# Altium schematic sheet Cyusb3014 - 2.SchDoc
size A3
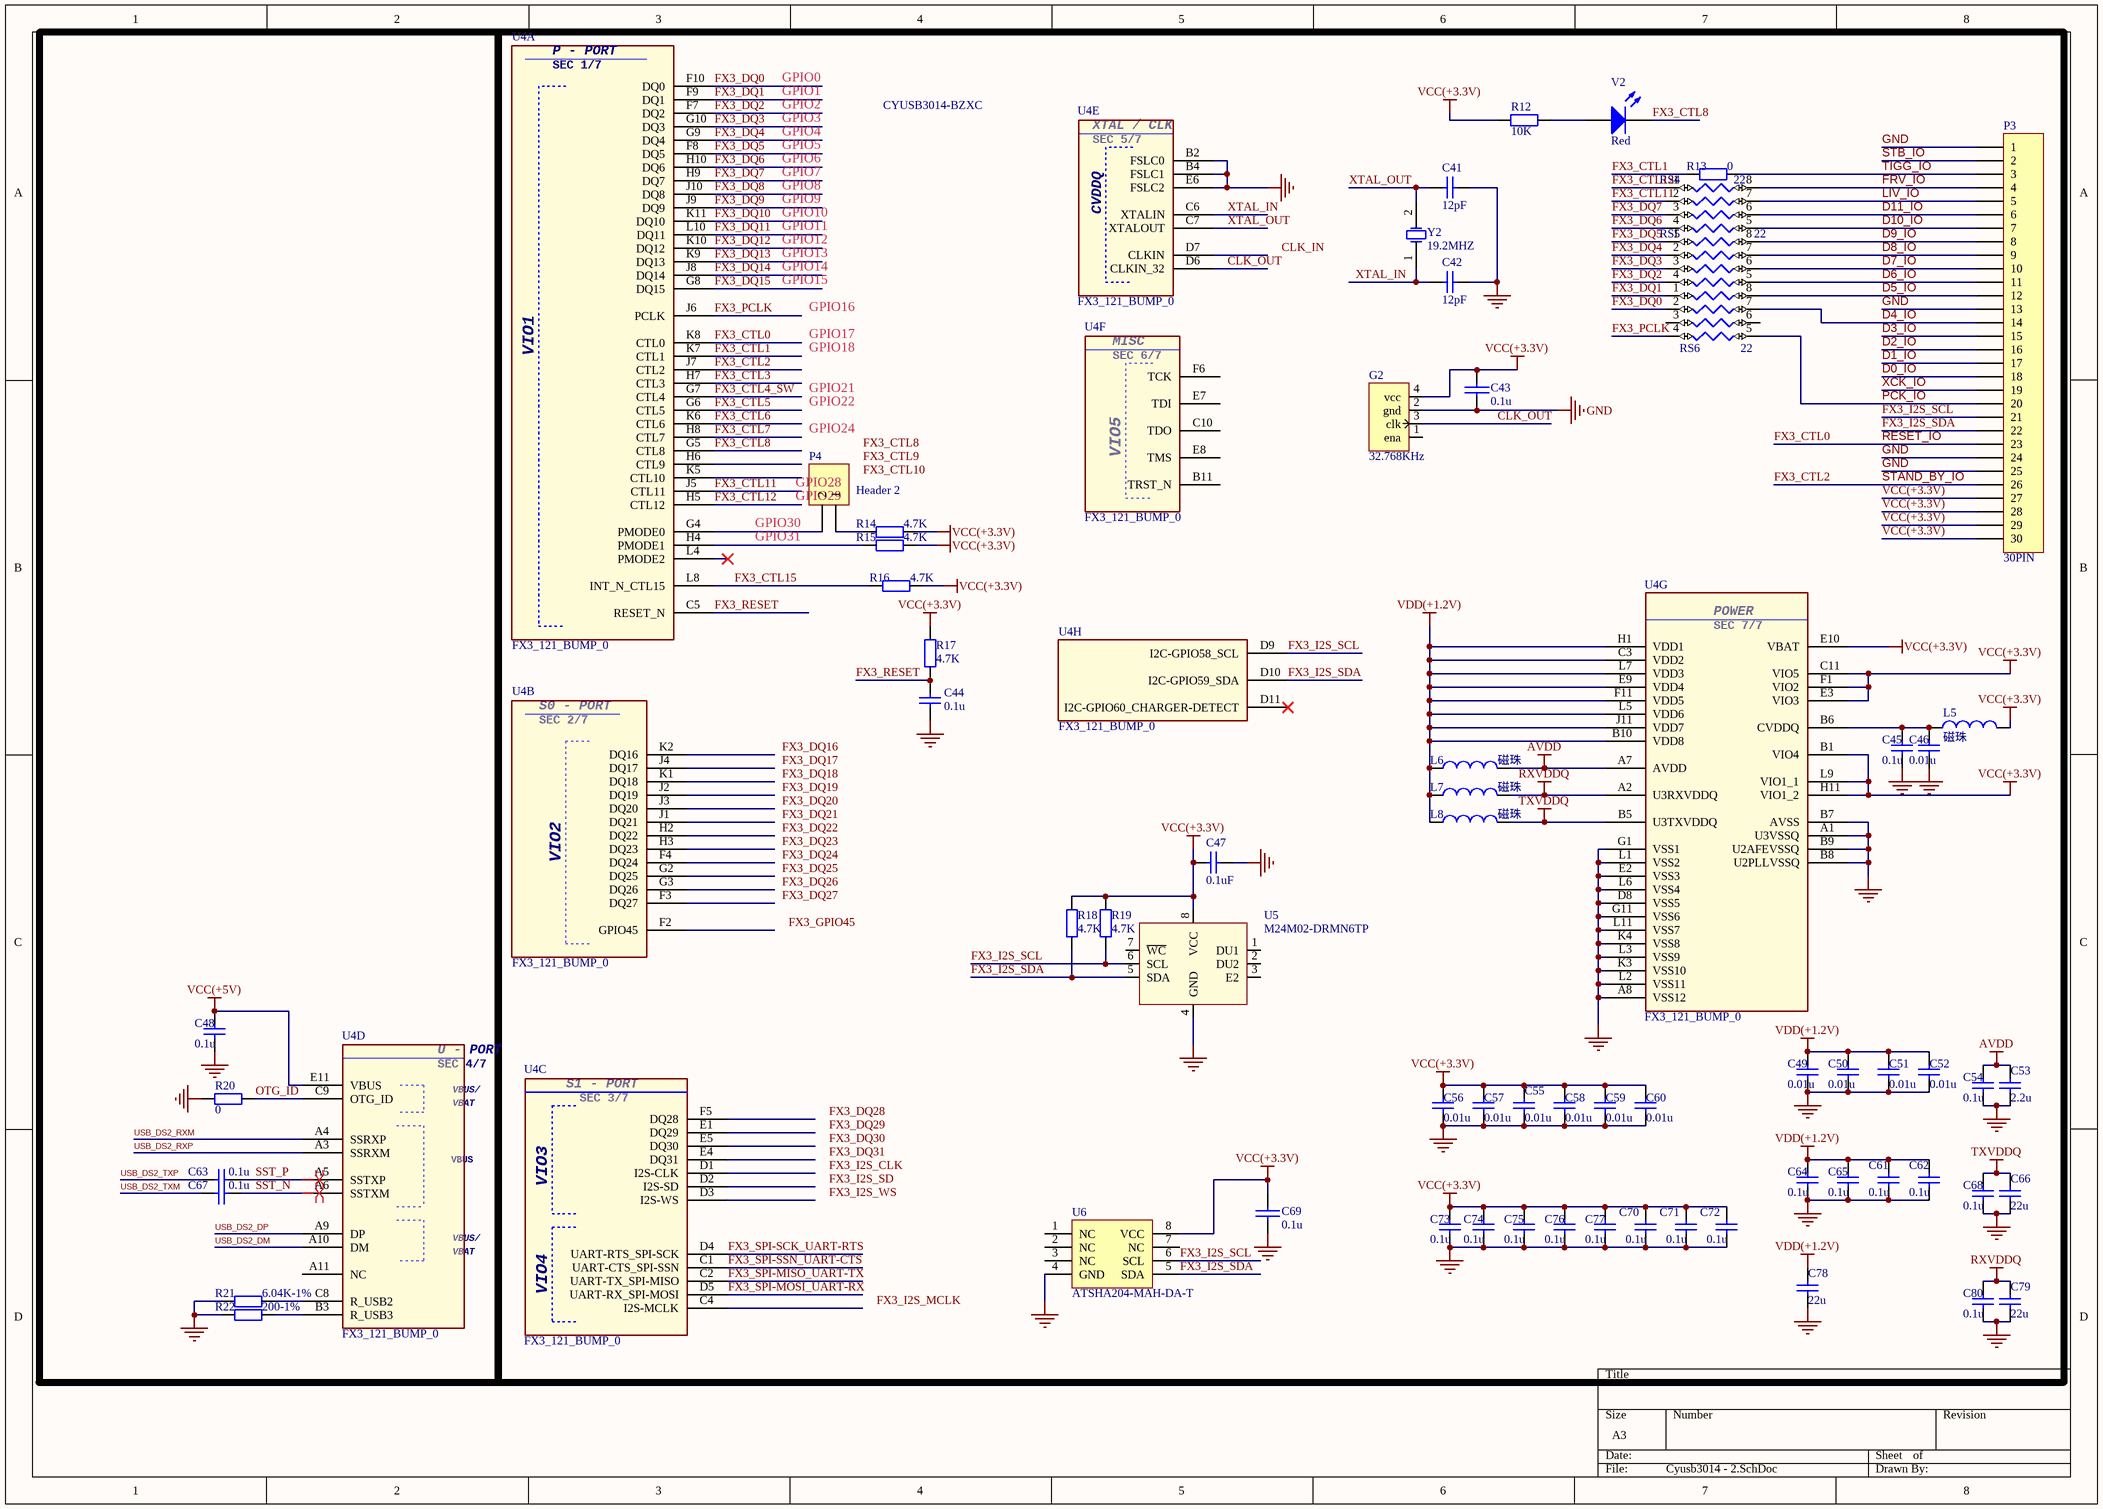
[diagram p0: Cyusb3014 - 2.SchDoc]

## Parts
C41  12pF  [0603S-CAP]
C42  12pF  [0603S-CAP]
C43  0.1u  [0603S-CAP]
C44  0.1u  [0603S-CAP]
C45  0.1u  [C0402]
C46  0.01u  [C0402]
C47  0.1uF  [0603S-CAP]
C48  0.1u  [C0402]
C49  0.01u  [C0402]
C50  0.01u  [C0402]
C51  0.01u  [C0402]
C52  0.01u  [C0402]
C53  2.2u  [C0805S-CAP]
C54  0.1u  [C0402]
C55  0.01u  [C0402]
C56  0.01u  [C0402]
C57  0.01u  [C0402]
C58  0.01u  [C0402]
C59  0.01u  [C0402]
C60  0.01u  [C0402]
C61  0.1u  [C0402]
C62  0.1u  [C0402]
C63  0.1u  [C0402]
C64  0.1u  [C0402]
C65  0.1u  [C0402]
C66  22u  [C0805S-CAP]
C67  0.1u  [C0402]
C68  0.1u  [C0402]
C69  0.1u  [0603S-CAP]
C70  0.1u  [C0402]
C71  0.1u  [C0402]
C72  0.1u  [C0402]
C73  0.1u  [C0402]
C74  0.1u  [C0402]
C75  0.1u  [C0402]
C76  0.1u  [C0402]
C77  0.1u  [C0402]
C78  22u  [C0805S-CAP]
C79  22u  [C0805S-CAP]
C80  0.1u  [C0402]
G2  32.768KHz  [爱普生晶振3.2×2.5mm]
L5  磁珠  [L0603]
L6  磁珠  [L0603]
L7  磁珠  [L0603]
L8  磁珠  [L0603]
P3  30PIN  [FH12-30S-0.5SH]
P4  Header 2  [HDR1X2]
R12  10K  [0603S-RES]
R13  0  [0603S-RES]
R14  4.7K  [0603S-RES]
R15  4.7K  [0603S-RES]
R16  4.7K  [0603S-RES]
R17  4.7K  [0603S-RES]
R18  4.7K  [0603S-RES]
R19  4.7K  [0603S-RES]
R20  0  [0603S-RES]
R21  6.04K-1%  [0603S-RES]
R22  200-1%  [0603S-RES]
RS4  22  [NC06-4]
RS5  22  [NC06-4]
RS6  22  [NC06-4]
U4  FX3_121_BUMP_0  [121_BGA_FX3]  (parts A,B,C,D,E,F,G,H of 8)
U5  M24M02-DRMN6TP  [SOIC127P600X175-8N]
U6  ATSHA204-MAH-DA-T  [UDFN]
V2  Red  [LED0805S]
Y2  19.2MHZ  [爱普生晶振3.2×2.5MM - 无源]

## Nets
AVDD: C53.2 C54.1 L6.2 U4.A7(AVDD)
GND: C41.1 C42.1 C43.2 C44.1 C45.2 C46.2 C47.1 C48.2 C49.2 C50.2 C51.2 C52.2 C53.1 C54.2 C55.2 C56.2 C57.2 C58.2 C59.2 C60.2 C61.2 C62.2 C64.2 C65.2 C66.1 C68.2 C69.2 C70.2 C71.2 C72.2 C73.2 C74.2 C75.2 C76.2 C77.2 C78.1 C79.1 C80.2 G2.2(gnd) P3.1 P3.13 P3.24 P3.25 R20.2 R21.2 R22.2 U4.A1(U3VSSQ) U4.A8(VSS12) U4.B2(FSLC0) U4.B4(FSLC1) U4.B7(AVSS) U4.B8(U2PLLVSSQ) U4.B9(U2AFEVSSQ) U4.D8(VSS5) U4.E2(VSS3) U4.E6(FSLC2) U4.G1(VSS1) U4.G11(VSS6) U4.K3(VSS10) U4.K4(VSS8) U4.L1(VSS2) U4.L2(VSS11) U4.L3(VSS9) U4.L6(VSS4) U4.L11(VSS7) U5.4(GND) U6.4(GND)
RXVDDQ: C79.2 C80.1 L7.2 U4.A2(U3RXVDDQ)
TXVDDQ: C66.2 C68.1 L8.2 U4.B5(U3TXVDDQ)
VCC(+3.3V): C43.1 C47.2 C55.1 C56.1 C57.1 C58.1 C59.1 C60.1 C69.1 C70.1 C71.1 C72.1 C73.1 C74.1 C75.1 C76.1 C77.1 G2.4(vcc) L5.2 P3.27 P3.28 P3.29 P3.30 R12.2 R14.2 R15.2 R16.1 R17.1 R18.2 R19.2 U4.B1(VIO4) U4.C11(VIO5) U4.E3(VIO3) U4.E10(VBAT) U4.F1(VIO2) U4.H11(VIO1_2) U4.L9(VIO1_1) U5.8(VCC) U6.8(VCC)
VCC(+5V): C48.1 U4.E11(VBUS)
VDD(+1.2V): C49.1 C50.1 C51.1 C52.1 C61.1 C62.1 C64.1 C65.1 C78.2 L6.1 L7.1 L8.1 U4.B10(VDD8) U4.C3(VDD2) U4.E9(VDD4) U4.F11(VDD5) U4.H1(VDD1) U4.J11(VDD7) U4.L5(VDD6) U4.L7(VDD3)
CLK_OUT: G2.3(clk) U4.D6(CLKIN_32)
D0_IO: P3.18
D1_IO: P3.17
D2_IO: P3.16
D3_IO: P3.15
D4_IO: P3.14 RS6.7
D5_IO: P3.12 RS6.8
D6_IO: P3.11 RS5.5
D7_IO: P3.10 RS5.6
D8_IO: P3.9 RS5.7
D9_IO: P3.8 RS5.8
D10_IO: P3.7 RS4.5
D11_IO: P3.6 RS4.6
FRV_IO: P3.4 RS4.8
FX3_CTL0: P3.23 U4.K8(CTL0)  [also labelled RESET_IO]
FX3_CTL1: R13.2 U4.K7(CTL1)
FX3_CTL2: P3.26 U4.J7(CTL2)  [also labelled STAND_BY_IO]
FX3_CTL3: U4.H7(CTL3)
FX3_CTL4_SW: U4.G7(CTL4)
FX3_CTL5: U4.G6(CTL5)
FX3_CTL6: U4.K6(CTL6)
FX3_CTL7: U4.H8(CTL7)
FX3_CTL8: U4.G5(CTL8) V2.2(K)
FX3_CTL11: RS4.2 U4.J5(CTL11)
FX3_CTL12: RS4.1 U4.H5(CTL12)
FX3_CTL15: R16.2 U4.L8(INT_N_CTL15)
FX3_DQ0: RS6.2 U4.F10(DQ0)
FX3_DQ1: RS6.1 U4.F9(DQ1)
FX3_DQ2: RS5.4 U4.F7(DQ2)
FX3_DQ3: RS5.3 U4.G10(DQ3)
FX3_DQ4: RS5.2 U4.G9(DQ4)
FX3_DQ5: RS5.1 U4.F8(DQ5)
FX3_DQ6: RS4.4 U4.H10(DQ6)
FX3_DQ7: RS4.3 U4.H9(DQ7)
FX3_DQ8: U4.J10(DQ8)
FX3_DQ9: U4.J9(DQ9)
FX3_DQ10: U4.K11(DQ10)
FX3_DQ11: U4.L10(DQ11)
FX3_DQ12: U4.K10(DQ12)
FX3_DQ13: U4.K9(DQ13)
FX3_DQ14: U4.J8(DQ14)
FX3_DQ15: U4.G8(DQ15)
FX3_I2S_SCL: P3.21 R19.1 U4.D9(I2C-GPIO58_SCL) U5.6(SCL) U6.6(SCL)
FX3_I2S_SDA: P3.22 R18.1 U4.D10(I2C-GPIO59_SDA) U5.5(SDA) U6.5(SDA)
FX3_PCLK: RS6.4 U4.J6(PCLK)
FX3_RESET: C44.2 R17.2 U4.C5(RESET_N)
FX3_SPI-MISO_UART-TX: U4.C2(UART-TX_SPI-MISO)
FX3_SPI-MOSI_UART-RX: U4.D5(UART-RX_SPI-MOSI)
FX3_SPI-SCK_UART-RTS: U4.D4(UART-RTS_SPI-SCK)
FX3_SPI-SSN_UART-CTS: U4.C1(UART-CTS_SPI-SSN)
LIV_IO: P3.5 RS4.7
OTG_ID: R20.1 U4.C9(OTG_ID)
PCK_IO: P3.20 RS6.5
SST_N: C67.2 U4.A6(SSTXM)
SST_P: C63.2 U4.A5(SSTXP)
STB_IO: P3.2
TIGG_IO: P3.3 R13.1
USB_DS2_DM: U4.A10(DM)
USB_DS2_DP: U4.A9(DP)
USB_DS2_RXM: U4.A4(SSRXP)
USB_DS2_RXP: U4.A3(SSRXM)
USB_DS2_TXM: C67.1
USB_DS2_TXP: C63.1
XCK_IO: P3.19
XTAL_IN: C42.2 U4.C6(XTALIN) Y2.1(OSC1)
XTAL_OUT: C41.2 U4.C7(XTALOUT) Y2.2(OSC2)
NetC45_1: C45.1 C46.1 L5.1 U4.B6(CVDDQ)
NetP4_1: P4.1 R14.1
NetP4_2: P4.2 U4.G4(PMODE0)
NetR12_1: R12.1 V2.1(A)
NetR15_1: R15.1 U4.H4(PMODE1)
NetR21_1: R21.1 U4.C8(R_USB2)
NetR22_1: R22.1 U4.B3(R_USB3)

Not connected (* = marked no-connect by the designer): G2 1(ena); RS6 3 6; U4 A11(NC) B11(TRST_N) C4(I2S-MCLK) C10(TDO) D1(I2S-CLK) D2(I2S-SD) D3(I2S-WS) D7(CLKIN) D11(I2C-GPIO60_CHARGER-DETECT)* E1(DQ29) E4(DQ31) E5(DQ30) E7(TDI) E8(TMS) F2(GPIO45) F3(DQ27) F4(DQ24) F5(DQ28) F6(TCK) G2(DQ25) G3(DQ26) H2(DQ22) H3(DQ23) H6(CTL9) J1(DQ21) J2(DQ19) J3(DQ20) J4(DQ17) K1(DQ18) K2(DQ16) K5(CTL10) L4(PMODE2)*; U5 1(DU1) 2(DU2) 3(E2) 7(~{WC}); U6 1(NC) 2(NC) 3(NC) 7(NC)

## Layout directives
differential pair: SST_N, SST_P

## Notes on the sheet
- GPIO0
- GPIO1
- GPIO2
- CYUSB3014-BZXC
- GPIO3
- GPIO4
- GPIO5
- GPIO6
- GPIO7
- GPIO8
- GPIO9
- GPIO10
- GPIO11
- GPIO12
- GPIO13
- GPIO14
- GPIO15
- GPIO16
- GPIO17
- GPIO18
- GPIO21
- GPIO22
- GPIO24
- (near P4) GPIO28
- (near P4) GPIO29
- (near P4) GPIO30
- (near P4) GPIO31
- Labels drawn without touching a wire or pin: CLK_IN, FX3_CTL8, FX3_CTL9, FX3_CTL10, FX3_DQ16, FX3_DQ17, FX3_DQ18, FX3_DQ19, FX3_DQ20, FX3_DQ21, FX3_DQ22, FX3_DQ23, FX3_DQ24, FX3_DQ25, FX3_DQ26, FX3_DQ27, FX3_DQ28, FX3_DQ29, FX3_DQ30, FX3_DQ31, FX3_GPIO45, FX3_I2S_CLK, FX3_I2S_MCLK, FX3_I2S_SD, FX3_I2S_WS
- (in symbol FX3_121_BUMP_0, part A) P - PORT; SEC 1/7; VIO1
- (in symbol FX3_121_BUMP_0, part B) S0 - PORT; SEC 2/7
- (in symbol FX3_121_BUMP_0, part C) S1 - PORT; SEC 3/7
- (in symbol FX3_121_BUMP_0, part D) U - PORT; SEC 4/7; VBUS/
- (in symbol FX3_121_BUMP_0, part E) XTAL / CLK; SEC 5/7
- (in symbol FX3_121_BUMP_0, part F) MISC; SEC 6/7
- (in symbol FX3_121_BUMP_0, part G) POWER; SEC 7/7

## Library data of the parts
C41 C42 = CAP CER SMT 4.3pF 0805: 2. Manufacturere Part Number: C0805C439D5GACTU; 1. Manufacturer: Kemet; 8. Alternate Part: any; 7. Package / Case: 0805; 0. Do Not Install: DNI; 6. Mounting Type: SMT; 5. Supplier Link: http://www.digikey.com/product-detail/en/C0805C439D5GACTU/C0805C439D5GACTU-ND/2212763; 3. Supplier: Digi-Key; 4. Supplier Part Number: C0805C439D5GACTU-ND
C43 C69 = CAP: RC=1206
C44 = Cap: 50V/8.2u/0805; Value: 100n; Published: 8-Jun-2000; LatestRevisionDate: 17-Jul-2002; LatestRevisionNote: Re-released for DXP Platform.; PackageReference: RAD-0.3; Publisher: Altium Limited
C45 C46 C48-C68 C70-C80 = CAP0805: Capacitor; Value: 104; Published: 8-Jun-2000; Revision: July-2002: Re-released for DXP Platform.; Publisher: Altium Limited
C47 = CAP SMT 0.1uF 16V X7R: 2. Manufacturere Part Number: C0805C104K4RACTU; 1. Manufacturer: Kemet; 8. Alternate Part: any; 7. Package / Case: 0805; 6. Mounting Type: SMT; 5. Supplier Link: http://www.digikey.com/product-detail/en/C0805C104K4RACTU/399-1167-1-ND/411442; 3. Supplier: Digi-Key; 4. Supplier Part Number: 399-1167-1-ND
G2 = CTY4-B
L5-L8 = Inductor: Code_IEC: 1005; Value: 10mH; Published: 8-Jun-2000; LatestRevisionDate: 29-May-2009; LatestRevisionNote: IPC-7351 Footprint Added.; PackageReference: 0402-A; Publisher: Altium Limited; PackageDescription: Chip Inductor; Code_JEITA: 0402
P3 = Header 30: Header, 30-Pin; LatestRevisionDate: 17-Jul-2002; LatestRevisionNote: Re-released for DXP Platform.; Publisher: Altium Limited
P4 = Header 2: Header, 2-Pin; LatestRevisionDate: 17-Jul-2002; LatestRevisionNote: Re-released for DXP Platform.; Publisher: Altium Limited
R12 = Res2: Resistor; Published: 8-Jun-2000; LatestRevisionDate: 17-Jul-2002; LatestRevisionNote: Re-released for DXP Platform.; PackageReference: AXIAL-0.4; Publisher: Altium Limited; Value: 10K
R13-R22 = Res2: Resistor; Value: 10K; Published: 8-Jun-2000; LatestRevisionDate: 17-Jul-2002; LatestRevisionNote: Re-released for DXP Platform.; PackageReference: AXIAL-0.4; Publisher: Altium Limited
RS4-RS6 = RN4: Option 2 - Device: *; Option 2 - Spec: *; Option 3 - Device: *; Option 3 - Spec: *; Option 4 - Device: *; Option 4 - Spec: *; Option 5 - Device: *; Option 5 - Spec: *; Option 6 - Device: *; Option 6 - Spec: *; Option 7 - Device: *; Option 7 - Spec: *; Option 8 - Device: *; Option 8 - Spec: *
U5 = 24LC64-I/SN: IC EEPROM 64KBIT 400KHZ 8SOIC; Manufacturer: Microchip Technology; Format - Memory: EEPROMs - Serial; Memory Size: 64K (8K x 8); Interface: I2C, 2-Wire Serial; Voltage - Supply: 2.5 V ~ 5.5 V; Supplier 1: Digi-Key; Manufacturer Part Number: 24LC64-I/SN; RoHS: RoHS Compliant; Category: Integrated Circuits (ICs); Stock 1: 16323; Pricing 1: 1=0.38, 25=0.37, 100=0.35 (USD); Packaging: Tube; Memory Type: EEPROM; Speed: 400kHz; Operating Temperature: -40°C ~ 85°C (TA); Package / Case: 8-SOIC (0.154", 3.90mm Width); Supplier Device Package: 8-SOIC; ComponentLink1URL: http://www.microchip.com/mymicrochip/filehandler.aspx?ddocname=en011843; ComponentLink1Description: http://www.microchip.com/mymicrochip/filehandler.aspx?ddocname=en011843; Supplier Part Number 1: 24LC64-I/SN-ND
U6 = AT24C128
V2 = LED0: Typical INFRARED GaAs LED; Published: 8-Jun-2000; LatestRevisionDate: 08-Jul-2005; LatestRevisionNote: Mech Layer 1 removed.; PackageReference: LED-0; Publisher: Altium Limited
Y2 = XTAL 32.768KHZ: Crystal, CRYSTAL 32.768KHZ 6PF SMD; 2. Manufacturere Part Number: ABS07-120-32.768KHZ-T; 1. Manufacturer: Abracon; 6. Mounting Type: SMT; 9. Notes: 2 pad - Abracon ABS07-120-32.768KHZ-T, 4 pad - Abracon ABS25-32.768KHZ-6-T; 0. Do Not Install: DNI; 5. Supplier Link: http://www.digikey.com/product-detail/en/ABS07-120-32.768KHZ-T/535-11937-1-ND/3724046; 3. Supplier: Digi-Key; 4. Supplier Part Number: 535-11937-1-ND